# Altium schematic sheet SP100 ATC CCU (SCH).SchDoc
size A2
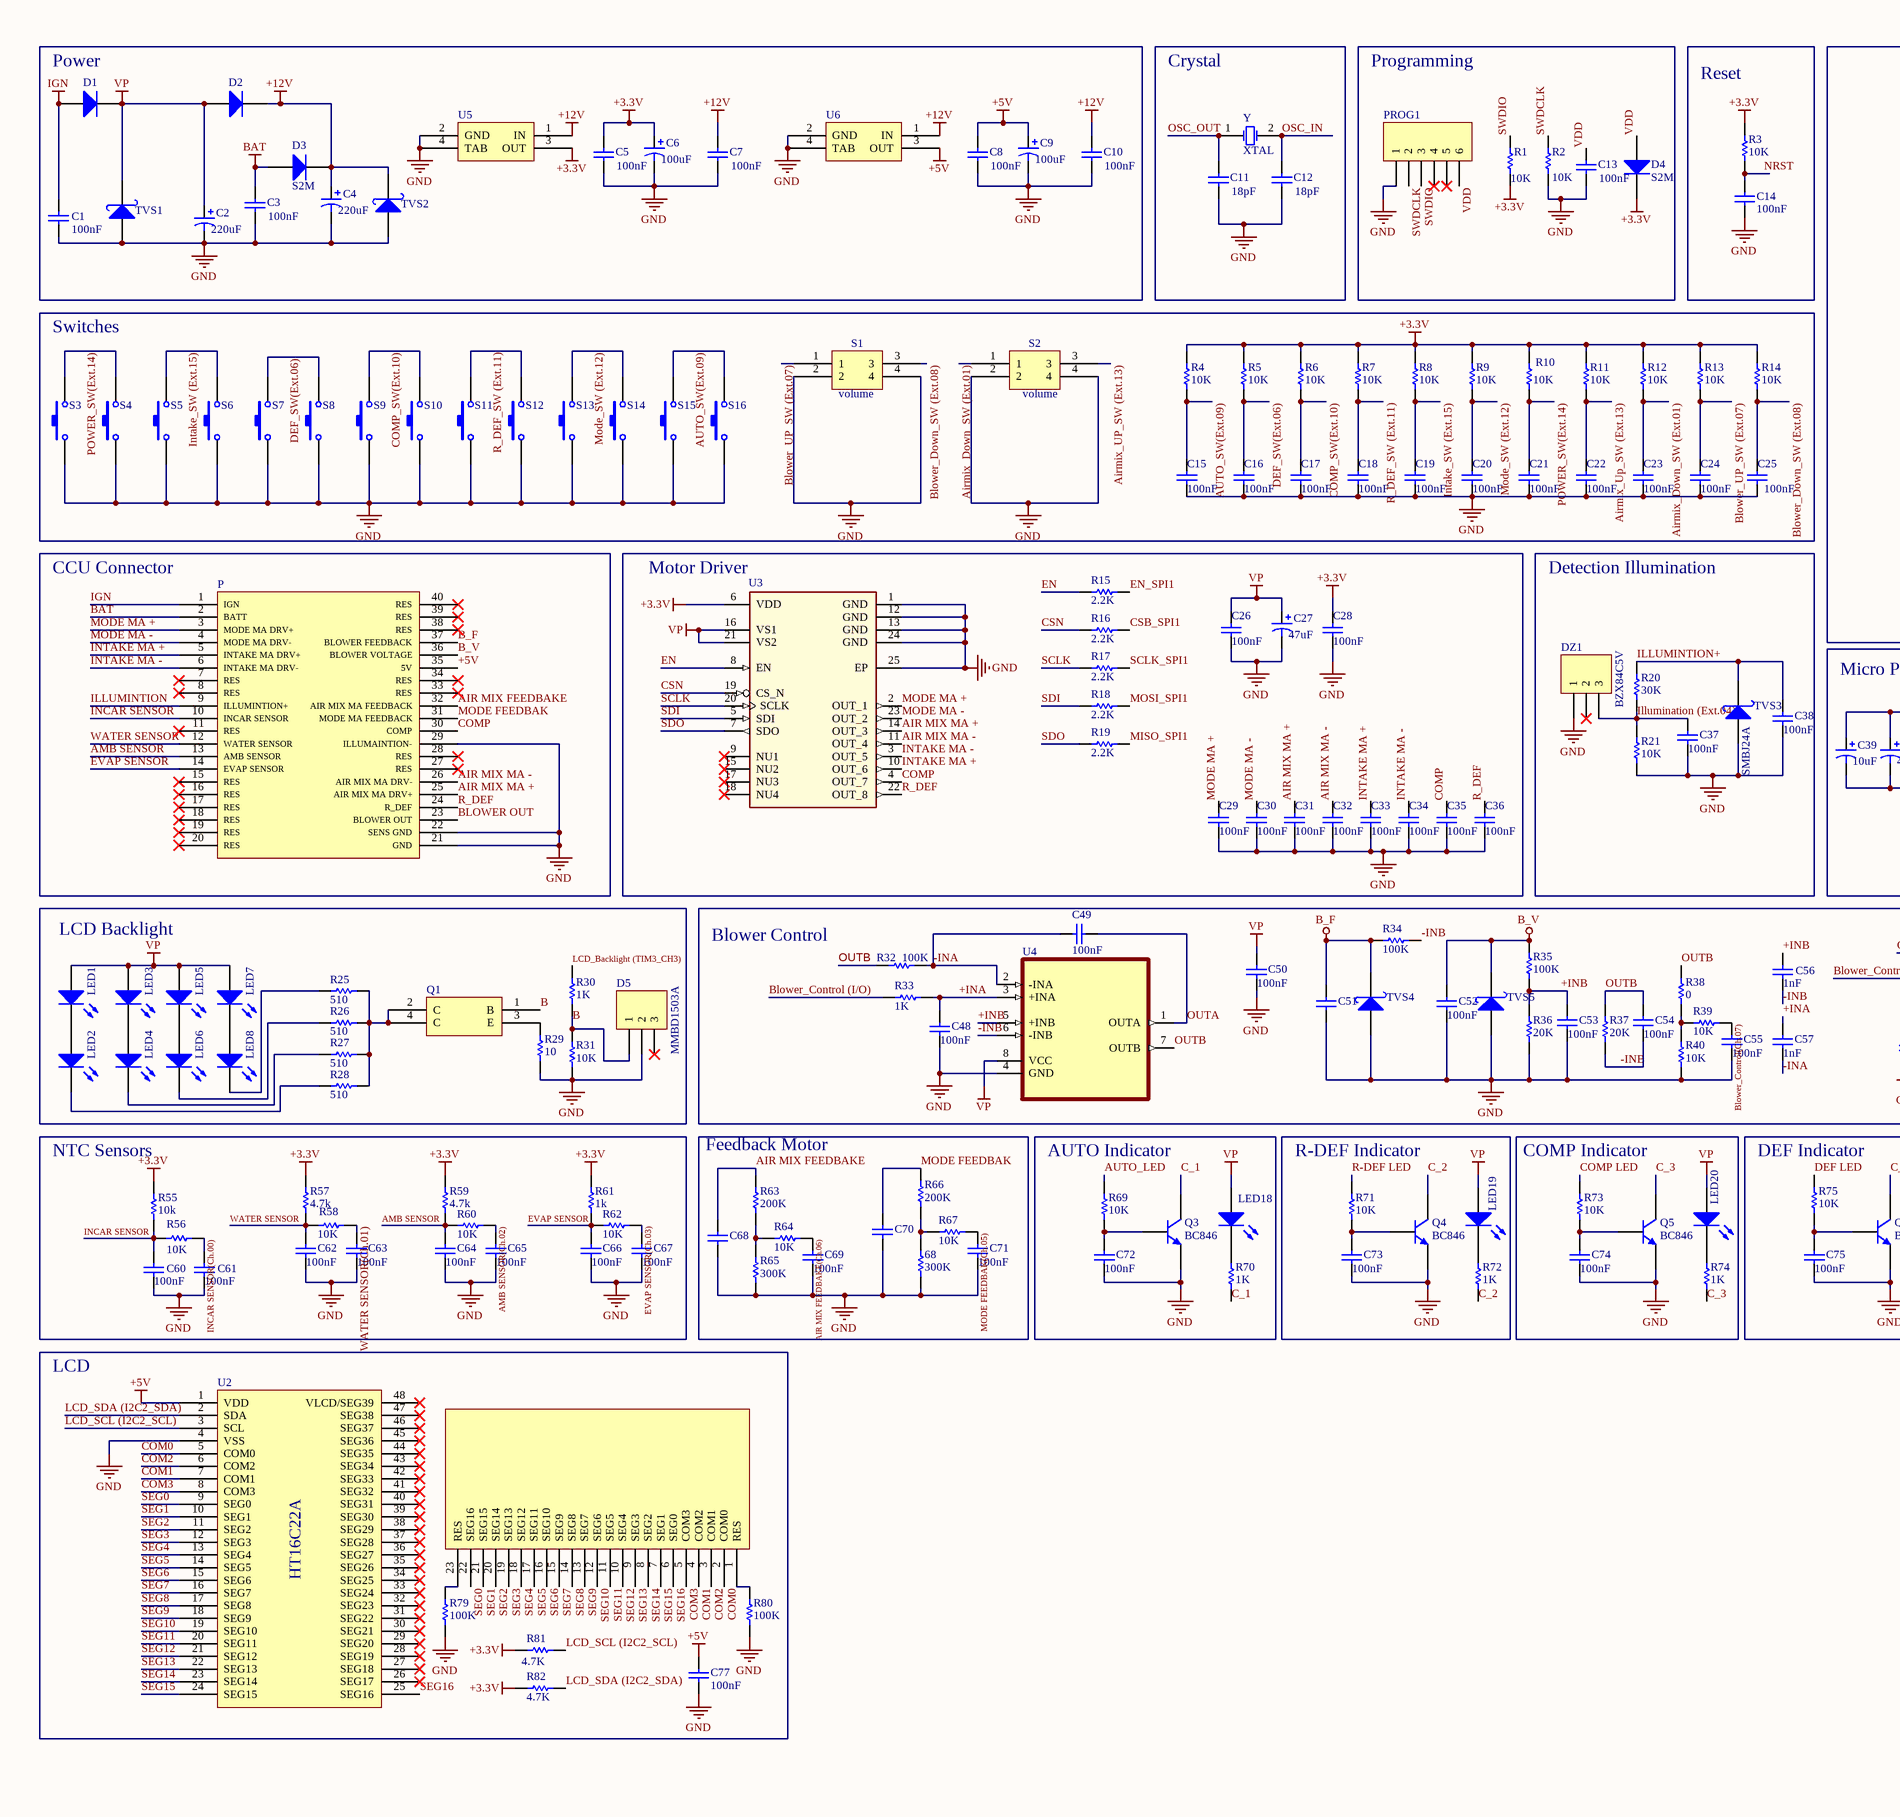
[diagram p0: SP100 ATC CCU (SCH).SchDoc, left]
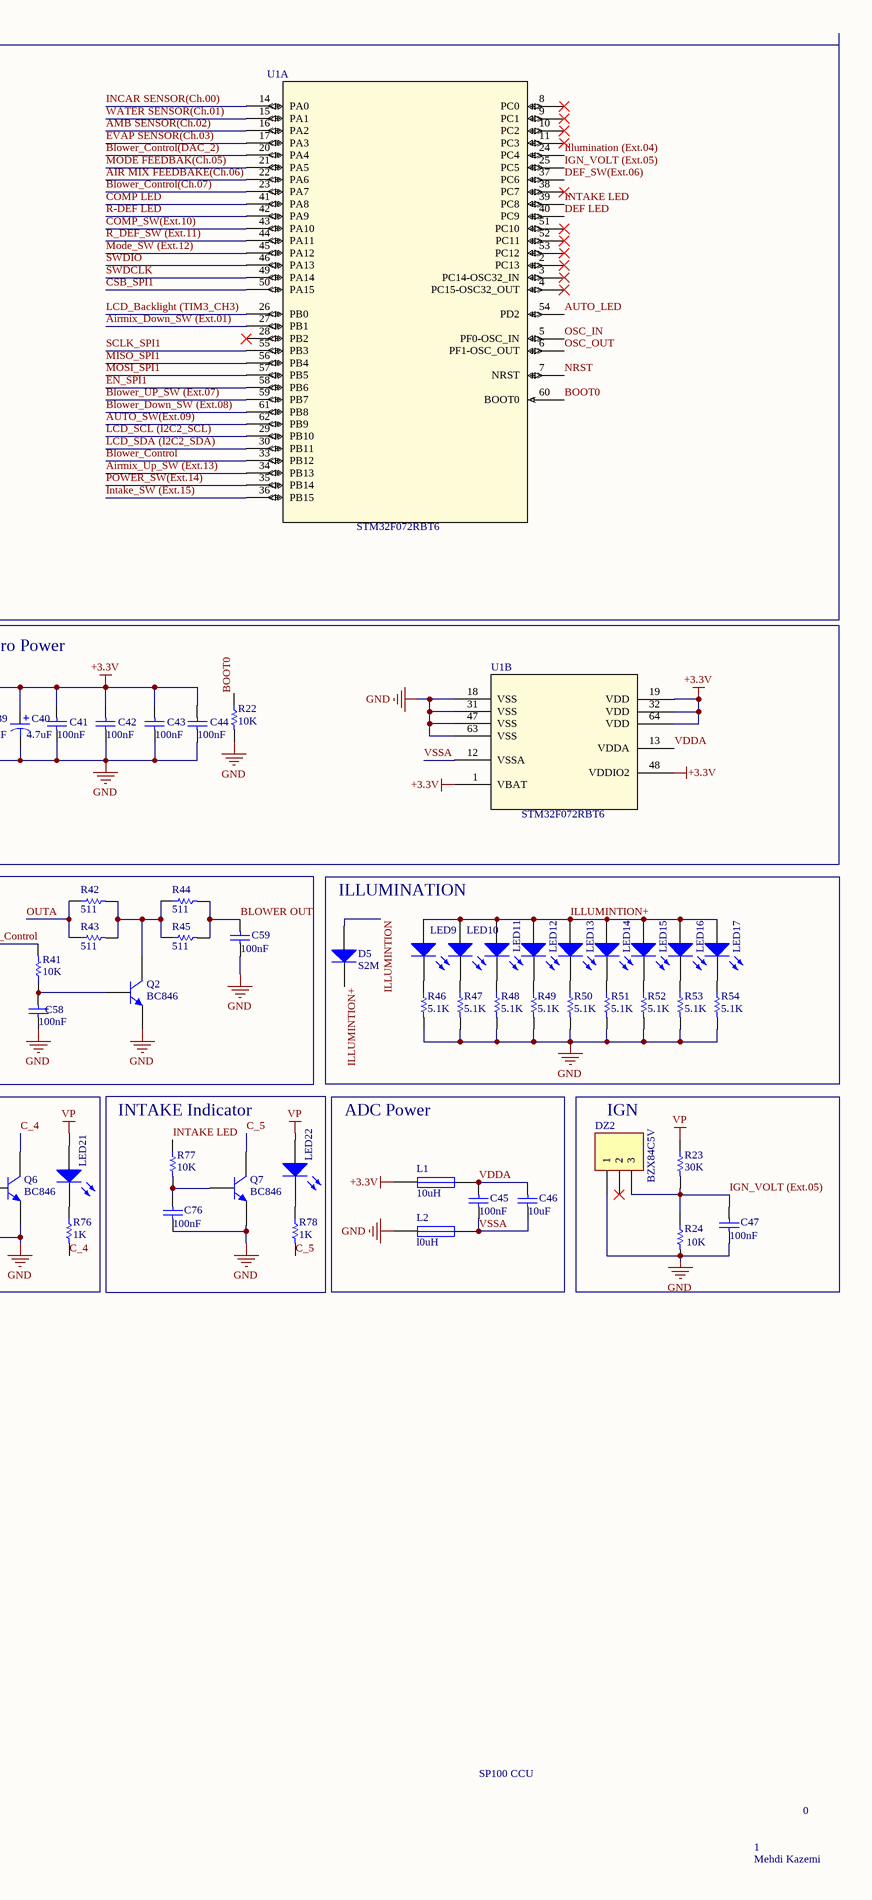
[diagram p1: SP100 ATC CCU (SCH).SchDoc, right]

## Parts
(Parts that share a designator on the sheet are numbered #1, #2 ... from top to bottom, then left to right.)
68  value 300K  [PCBComponent_1]  (hidden comment: Res1)
?  (no value)
C1  value 100nF  [PCBComponent_1]
C2  value 220uF  [PCBComponent_1]
C3  value 100nF  [PCBComponent_1]
C4  value 220uF  [PCBComponent_1]
C5  value 100nF  [PCBComponent_1]
C6  value 100uF  [PCBComponent_1]
C7  value 100nF  [PCBComponent_1]
C8  value 100nF  [PCBComponent_1]
C9  value 100uF  [PCBComponent_1]
C10  value 100nF  [PCBComponent_1]
C11  value 18pF  [PCBComponent_1]
C12  value 18pF  [PCBComponent_1]
C13  value 100nF  [PCBComponent_1]
C14  value 100nF  [PCBComponent_1]  (hidden comment: Cap)
C15  value 100nF  [PCBComponent_1]
C16  value 100nF  [PCBComponent_1]
C17  value 100nF  [PCBComponent_1]
C18  value 100nF  [PCBComponent_1]
C19  value 100nF  [PCBComponent_1]
C20  value 100nF  [PCBComponent_1]
C21  value 100nF  [PCBComponent_1]
C22  value 100nF  [PCBComponent_1]
C23  value 100nF  [PCBComponent_1]
C24  value 100nF  [PCBComponent_1]
C25  value 100nF  [PCBComponent_1]
C26  value 100nF  [PCBComponent_1]
C27  value 47uF  [PCBComponent_1]
C28  value 100nF  [PCBComponent_1]
C29  value 100nF  [PCBComponent_1]
C30  value 100nF  [PCBComponent_1]
C31  value 100nF  [PCBComponent_1]
C32  value 100nF  [PCBComponent_1]
C33  value 100nF  [PCBComponent_1]
C34  value 100nF  [PCBComponent_1]
C35  value 100nF  [PCBComponent_1]
C36  value 100nF  [PCBComponent_1]
C37  value 100nF  [PCBComponent_1]
C38  value 100nF  [PCBComponent_1]
C39  value 10uF  [PCBComponent_1]
C40  value 4.7uF  [PCBComponent_1]
C41  value 100nF  [PCBComponent_1]
C42  value 100nF  [PCBComponent_1]
C43  value 100nF  [PCBComponent_1]
C44  value 100nF  [PCBComponent_1]
C45  value 100nF  [PCBComponent_1]
C46  value 10uF  [PCBComponent_1]
C47  value 100nF  [PCBComponent_1]
C48  value 100nF  [PCBComponent_1]
C49  value 100nF  [PCBComponent_1]
C50  value 100nF  [PCBComponent_1]
C51  (no value)  [PCBComponent_1]
C52  value 100nF  [PCBComponent_1]
C53  value 100nF  [PCBComponent_1]
C54  value 100nF  [PCBComponent_1]
C55  value 100nF  [PCBComponent_1]
C56  value 1nF  [PCBComponent_1]
C57  value 1nF  [PCBComponent_1]
C58  value 100nF  [PCBComponent_1]
C59  value 100nF  [PCBComponent_1]
C60  value 100nF  [PCBComponent_1]
C61  value 100nF  [PCBComponent_1]
C62  value 100nF  [PCBComponent_1]
C63  value 100nF  [PCBComponent_1]
C64  value 100nF  [PCBComponent_1]
C65  value 100nF  [PCBComponent_1]
C66  value 100nF  [PCBComponent_1]
C67  value 100nF  [PCBComponent_1]
C68  (no value)  [PCBComponent_1]
C69  value 100nF  [PCBComponent_1]
C70  (no value)  [PCBComponent_1]
C71  value 100nF  [PCBComponent_1]
C72  value 100nF  [PCBComponent_1]
C73  value 100nF  [PCBComponent_1]
C74  value 100nF  [PCBComponent_1]
C75  value 100nF  [PCBComponent_1]
C76  value 100nF  [PCBComponent_1]
C77  value 100nF  [PCBComponent_1]
D1  (no value)  [PCBComponent_1]
D2  (no value)  [PCBComponent_1]
D3  S2M  [PCBComponent_1]
D4  S2M  [SODFL3517X110N]
D5#1  S2M  [PCBComponent_1]
D5#2  MMBD1503A  [PCBComponent_1]
DZ1  BZX84C5V  [PCBComponent_1]
DZ2  BZX84C5V  [PCBComponent_1]
L1  10uH  [PCBComponent_1]
L2  l0uH  [PCBComponent_1]
LED1  (no value)  [PCBComponent_1]
LED2  (no value)  [PCBComponent_1]
LED3  (no value)  [PCBComponent_1]
LED4  (no value)  [PCBComponent_1]
LED5  (no value)  [PCBComponent_1]
LED6  (no value)  [PCBComponent_1]
LED7  (no value)  [PCBComponent_1]
LED8  (no value)  [PCBComponent_1]
LED9  (no value)  [PCBComponent_1]
LED10  (no value)  [PCBComponent_1]
LED11  (no value)  [PCBComponent_1]
LED12  (no value)  [PCBComponent_1]
LED13  (no value)  [PCBComponent_1]
LED14  (no value)  [PCBComponent_1]
LED15  (no value)  [PCBComponent_1]
LED16  (no value)  [PCBComponent_1]
LED17  (no value)  [PCBComponent_1]
LED18  (no value)  [PCBComponent_1]
LED19  (no value)  [PCBComponent_1]
LED20  (no value)  [PCBComponent_1]
LED21  (no value)  [PCBComponent_1]
LED22  (no value)  [PCBComponent_1]
P  (no value)  [PCBComponent_1]
PROG1  (no value)  [PCBComponent_1]
Q1  (no value)  [*SOT223]
Q2  BC846  [PCBComponent_1]
Q3  BC846  [PCBComponent_1]
Q4  BC846  [PCBComponent_1]
Q5  BC846  [PCBComponent_1]
Q6  BC846  [PCBComponent_1]
Q7  BC846  [PCBComponent_1]
R1  value 10K  [PCBComponent_1]
R2  value 10K  [PCBComponent_1]
R3  value 10K  [PCBComponent_1]  (hidden comment: Res1)
R4  value 10K  [PCBComponent_1]  (hidden comment: Res1)
R5  value 10K  [PCBComponent_1]  (hidden comment: Res1)
R6  value 10K  [PCBComponent_1]  (hidden comment: Res1)
R7  value 10K  [PCBComponent_1]  (hidden comment: Res1)
R8  value 10K  [PCBComponent_1]  (hidden comment: Res1)
R9  value 10K  [PCBComponent_1]  (hidden comment: Res1)
R10  value 10K  [PCBComponent_1]  (hidden comment: Res1)
R11  value 10K  [PCBComponent_1]  (hidden comment: Res1)
R12  value 10K  [PCBComponent_1]  (hidden comment: Res1)
R13  value 10K  [PCBComponent_1]  (hidden comment: Res1)
R14  value 10K  [PCBComponent_1]  (hidden comment: Res1)
R15  value 2.2K  [PCBComponent_1]  (hidden comment: Res1)
R16  value 2.2K  [PCBComponent_1]  (hidden comment: Res1)
R17  value 2.2K  [PCBComponent_1]  (hidden comment: Res1)
R18  value 2.2K  [PCBComponent_1]  (hidden comment: Res1)
R19  value 2.2K  [PCBComponent_1]  (hidden comment: Res1)
R20  value 30K  [PCBComponent_1]  (hidden comment: Res1)
R21  value 10K  [PCBComponent_1]  (hidden comment: Res1)
R22  value 10K  [PCBComponent_1]  (hidden comment: Res1)
R23  value 30K  [PCBComponent_1]  (hidden comment: Res1)
R24  value 10K  [PCBComponent_1]  (hidden comment: Res1)
R25  value 510  [PCBComponent_1]  (hidden comment: Res1)
R26  value 510  [PCBComponent_1]  (hidden comment: Res1)
R27  value 510  [PCBComponent_1]  (hidden comment: Res1)
R28  value 510  [PCBComponent_1]  (hidden comment: Res1)
R29  value 10  [PCBComponent_1]  (hidden comment: Res1)
R30  value 1K  [PCBComponent_1]  (hidden comment: Res1)
R31  value 10K  [PCBComponent_1]  (hidden comment: Res1)
R32  value 100K  [PCBComponent_1]  (hidden comment: Res1)
R33  value 1K  [PCBComponent_1]  (hidden comment: Res1)
R34  value 100K  [PCBComponent_1]  (hidden comment: Res1)
R35  value 100K  [PCBComponent_1]  (hidden comment: Res1)
R36  value 20K  [PCBComponent_1]  (hidden comment: Res1)
R37  value 20K  [PCBComponent_1]  (hidden comment: Res1)
R38  value 0  [PCBComponent_1]  (hidden comment: Res1)
R39  value 10K  [PCBComponent_1]  (hidden comment: Res1)
R40  value 10K  [PCBComponent_1]  (hidden comment: Res1)
R41  value 10K  [PCBComponent_1]  (hidden comment: Res1)
R42  value 511  [PCBComponent_1]  (hidden comment: Res1)
R43  value 511  [PCBComponent_1]  (hidden comment: Res1)
R44  value 511  [PCBComponent_1]  (hidden comment: Res1)
R45  value 511  [PCBComponent_1]  (hidden comment: Res1)
R46  value 5.1K  [PCBComponent_1]  (hidden comment: Res1)
R47  value 5.1K  [PCBComponent_1]  (hidden comment: Res1)
R48  value 5.1K  [PCBComponent_1]  (hidden comment: Res1)
R49  value 5.1K  [PCBComponent_1]  (hidden comment: Res1)
R50  value 5.1K  [PCBComponent_1]  (hidden comment: Res1)
R51  value 5.1K  [PCBComponent_1]  (hidden comment: Res1)
R52  value 5.1K  [PCBComponent_1]  (hidden comment: Res1)
R53  value 5.1K  [PCBComponent_1]  (hidden comment: Res1)
R54  value 5.1K  [PCBComponent_1]  (hidden comment: Res1)
R55  value 10k  [PCBComponent_1]  (hidden comment: Res1)
R56  value 10K  [PCBComponent_1]  (hidden comment: Res1)
R57  value 4.7k  [PCBComponent_1]  (hidden comment: Res1)
R58  value 10K  [PCBComponent_1]  (hidden comment: Res1)
R59  value 4.7k  [PCBComponent_1]  (hidden comment: Res1)
R60  value 10K  [PCBComponent_1]  (hidden comment: Res1)
R61  value 1k  [PCBComponent_1]  (hidden comment: Res1)
R62  value 10K  [PCBComponent_1]  (hidden comment: Res1)
R63  value 200K  [PCBComponent_1]  (hidden comment: Res1)
R64  value 10K  [PCBComponent_1]  (hidden comment: Res1)
R65  value 300K  [PCBComponent_1]  (hidden comment: Res1)
R66  value 200K  [PCBComponent_1]  (hidden comment: Res1)
R67  value 10K  [PCBComponent_1]  (hidden comment: Res1)
R69  value 10K  [PCBComponent_1]  (hidden comment: Res1)
R70  value 1K  [PCBComponent_1]  (hidden comment: Res1)
R71  value 10K  [PCBComponent_1]  (hidden comment: Res1)
R72  value 1K  [PCBComponent_1]  (hidden comment: Res1)
R73  value 10K  [PCBComponent_1]  (hidden comment: Res1)
R74  value 1K  [PCBComponent_1]  (hidden comment: Res1)
R75  value 10K  [PCBComponent_1]  (hidden comment: Res1)
R76  value 1K  [PCBComponent_1]  (hidden comment: Res1)
R77  value 10K  [PCBComponent_1]  (hidden comment: Res1)
R78  value 1K  [PCBComponent_1]  (hidden comment: Res1)
R79  value 100K  [PCBComponent_1]  (hidden comment: Res1)
R80  value 100K  [PCBComponent_1]  (hidden comment: Res1)
R81  value 4.7K  [PCBComponent_1]  (hidden comment: Res1)
R82  value 4.7K  [PCBComponent_1]  (hidden comment: Res1)
S1  volume  [PCBComponent_1]
S2  volume  [PCBComponent_1]
S3  (no value)  [PCBComponent_1]
S4  (no value)  [PCBComponent_1]
S5  (no value)  [PCBComponent_1]
S6  (no value)  [PCBComponent_1]
S7  (no value)  [PCBComponent_1]
S8  (no value)  [PCBComponent_1]
S9  (no value)  [PCBComponent_1]
S10  (no value)  [PCBComponent_1]
S11  (no value)  [PCBComponent_1]
S12  (no value)  [PCBComponent_1]
S13  (no value)  [PCBComponent_1]
S14  (no value)  [PCBComponent_1]
S15  (no value)  [PCBComponent_1]
S16  (no value)  [PCBComponent_1]
TVS1  (no value)  [PCBComponent_1]
TVS2  (no value)  [PCBComponent_1]
TVS3  SMBJ24A  [PCBComponent_1]
TVS4  (no value)  [PCBComponent_1]
TVS5  (no value)  [PCBComponent_1]
U1  STM32F072RBT6  [PCBComponent_1]  (parts A,B of 2)
U2  (no value)  [QFP50P900X900X160-48N]
U3  (no value)  [SOP65P600X115-25N-1]
U4  (no value)  [SOIC127P600X175-8N]
U5  (no value)  [*SOT223]
U6  (no value)  [*SOT223]
Y  XTAL  [PCBComponent_1]

## Nets
+3.3V: C5.2 C6.1 C28.2 C39.1 C40.1 C41.1 C42.1 C43.1 C44.1 D4.2(K) L1.1 R1.1 R3.2 R4.1 R5.1 R6.1 R7.1 R8.1 R9.1 R10.1 R11.1 R12.1 R13.1 R14.1 R55.1 R57.1 R59.1 R61.1 R81.1 R82.1 U1.1(VBAT) U1.19(VDD) U1.32(VDD) U1.48(VDDIO2) U1.64(VDD) U3.6(VDD) U5.3(OUT)
+5V: C8.2 C9.1 C77.2 P.35(5V) U2.1(VDD) U6.3(OUT)
+12V: C4.1 C7.2 C10.2 D2.2(K) D3.2(K) TVS2.2(K) U5.1(IN) U6.1(IN)
B_F: C51.1 P.37(BLOWER_FEEDBACK) R34.1 TVS4.2(K)
B_V: C52.2 P.36(BLOWER_VOLTAGE) R35.1 TVS5.2(K)
BAT: C3.2 D3.1(A) P.2(BATT)
GND: 68.2 C1.1 C2.2 C3.1 C4.2 C5.1 C6.2 C7.1 C8.1 C9.2 C10.1 C11.1 C12.1 C13.1 C14.1 C15.1 C16.1 C17.1 C18.1 C19.1 C20.1 C21.1 C22.1 C23.1 C24.1 C25.1 C26.1 C27.2 C28.1 C29.1 C30.1 C31.1 C32.1 C33.1 C34.1 C35.1 C36.1 C37.1 C38.1 C39.2 C40.2 C41.2 C42.2 C43.2 C44.2 C47.1 C48.1 C50.1 C51.2 C52.1 C53.1 C55.1 C58.1 C59.1 C60.1 C61.1 C62.1 C63.1 C64.1 C65.1 C66.1 C67.1 C68.2 C69.1 C70.2 C71.1 C72.1 C73.1 C74.1 C75.1 C76.1 C77.1 D5#2.2 DZ1.1 DZ2.1 L2.1 P.21(GND) P.22(SENS_GND) P.29(ILLUMAINTION-) PROG1.1 Q2.2(E) Q3.2(E) Q4.2(E) Q5.2(E) Q6.2(E) Q7.2(E) R2.1 R21.2 R22.2 R24.2 R29.2 R31.2 R36.1 R40.2 R46.2 R47.2 R48.2 R49.2 R50.2 R51.2 R52.2 R53.2 R54.2 R65.2 R79.2 R80.2 S1.2 S1.4 S2.2 S2.4 S3.1 S4.1 S5.1 S6.1 S7.1 S8.1 S9.1 S10.1 S11.1 S12.1 S13.1 S14.1 S15.1 S16.1 TVS1.1(A) TVS2.1(A) TVS3.1(A) TVS4.1(A) TVS5.1(A) U1.18(VSS) U1.31(VSS) U1.47(VSS) U1.63(VSS) U2.4(VSS) U3.1(GND) U3.12(GND) U3.13(GND) U3.24(GND) U3.25(EP) U4.4(GND) U5.2(GND) U5.4(TAB) U6.2(GND) U6.4(TAB)
IGN: C1.2 D1.1(A) P.1(IGN)
VP: C2.1 C26.2 C27.1 C50.2 D1.2(K) D2.1(A) LED1.1(A) LED3.1(A) LED5.1(A) LED7.1(A) LED18.1(A) LED19.1(A) LED20.1(A) LED21.1(A) LED22.1(A) R23.1 TVS1.2(K) U3.16(VS1) U3.21(VS2) U4.8(VCC)
+INA: C48.2 C57.2 R33.1 U4.3(+INA)
+INB: C53.2 C56.2 R35.2 R36.2 U4.5(+INB)
-INA: C49.2 C57.1 R32.1 U4.2(-INA)
-INB: C54.1 C56.1 R34.2 R37.2 U4.6(-INB)
AIR MIX FEEDBAKE: C68.1 P.32(AIR_MIX_MA_FEEDBACK) R63.1
AIR MIX FEEDBAKE(Ch.06): C69.2 R64.2 U1.22(PA6)
AIR MIX MA +: C31.2 P.25(AIR_MIX_MA_DRV+) U3.14(OUT_3)
AIR MIX MA -: C32.2 P.26(AIR_MIX_MA_DRV-) U3.11(OUT_4)
Airmix_Down_SW (Ext.01): C23.2 R12.2 S2.1 U1.27(PB1)
Airmix_Up_SW (Ext.13): C22.2 R11.2 S2.3 U1.34(PB13)
AMB SENSOR: C64.2 P.13(AMB_SENSOR) R59.2 R60.2
AMB SENSOR(Ch.02): C65.2 R60.1 U1.16(PA2)
AUTO_LED: R69.1 U1.54(PD2)
AUTO_SW(Ext.09): C15.2 R4.2 S15.2 S16.2 U1.62(PB9)
B: D5#2.1 Q1.1(B) R30.2 R31.1
BLOWER OUT: C59.2 P.23(BLOWER_OUT) R44.2 R45.2
Blower_Control: R41.2 U1.33(PB12)
Blower_Control (I/O): R33.2
Blower_Control(Ch.07): C55.2 R39.2 U1.23(PA7)
Blower_Control(DAC_2): U1.20(PA4)
Blower_Down_SW (Ext.08): C25.2 R14.2 S1.3 U1.61(PB8)
Blower_UP_SW (Ext.07): C24.2 R13.2 S1.1 U1.59(PB7)
BOOT0: R22.1 U1.60(BOOT0)
C_1: Q3.3(C) R70.2
C_2: Q4.3(C) R72.2
C_3: Q5.3(C) R74.2
C_4: Q6.3(C) R76.2
C_5: Q7.3(C) R78.2
COM0: ?.2(COM0) U2.5(COM0)
COM1: ?.4(COM2) U2.7(COM1)
COM2: ?.3(COM1) U2.6(COM2)
COM3: ?.5(COM3) U2.8(COM3)
COMP: C35.2 P.30(COMP) U3.4(OUT_7)
COMP LED: R73.1 U1.41(PA8)
COMP_SW(Ext.10): C17.2 R6.2 S9.2 S10.2 U1.43(PA10)
CSB_SPI1: R16.1 U1.50(PA15)
CSN: R16.2 U3.19(CS_N)
DEF LED: R75.1 U1.40(PC9)
DEF_SW(Ext.06): C16.2 R5.2 S7.2 S8.2 U1.37(PC6)
EN: R15.2 U3.8(EN)
EN_SPI1: R15.1 U1.58(PB6)
EVAP SENSOR: C66.2 P.14(EVAP_SENSOR) R61.2 R62.2
EVAP SENSOR(Ch.03): C67.2 R62.1 U1.17(PA3)
IGN_VOLT (Ext.05): C47.2 DZ2.3 R23.2 R24.1 U1.25(PC5)
Illumination (Ext.04): C37.2 DZ1.3 R20.2 R21.1 U1.24(PC4)
ILLUMINTION: D5#1.1(A) P.9(ILLUMINTION+)
ILLUMINTION+: C38.2 D5#1.2(K) LED9.1(A) LED10.1(A) LED11.1(A) LED12.1(A) LED13.1(A) LED14.1(A) LED15.1(A) LED16.1(A) LED17.1(A) R20.1 TVS3.2(K)
INCAR SENSOR: C60.2 P.10(INCAR_SENSOR) R55.2 R56.2
INCAR SENSOR(Ch.00): C61.2 R56.1 U1.14(PA0)
INTAKE LED: R77.1 U1.39(PC8)
INTAKE MA +: C33.2 P.5(INTAKE_MA_DRV+) U3.10(OUT_6)
INTAKE MA -: C34.2 P.6(INTAKE_MA_DRV-) U3.3(OUT_5)
Intake_SW (Ext.15): C19.2 R8.2 S5.2 S6.2 U1.36(PB15)
LCD_Backlight (TIM3_CH3): R30.1 U1.26(PB0)
LCD_SCL (I2C2_SCL): R81.2 U1.29(PB10) U2.3(SCL)
LCD_SDA (I2C2_SDA): R82.2 U1.30(PB11) U2.2(SDA)
MISO_SPI1: R19.1 U1.56(PB4)
MODE FEEDBAK: C70.1 P.31(MODE_MA_FEEDBACK) R66.1
MODE FEEDBAK(Ch.05): C71.2 R67.2 U1.21(PA5)
MODE MA +: C29.2 P.3(MODE_MA_DRV+) U3.2(OUT_1)
MODE MA -: C30.2 P.4(MODE_MA_DRV-) U3.23(OUT_2)
Mode_SW (Ext.12): C20.2 R9.2 S13.2 S14.2 U1.45(PA12)
MOSI_SPI1: R18.1 U1.57(PB5)
NRST: C14.2 R3.1 U1.7(NRST)
OSC_IN: C12.2 U1.5(PF0-OSC_IN) Y.2(OSC2)
OSC_OUT: C11.2 U1.6(PF1-OSC_OUT) Y.1(OSC1)
OUTA: C49.1 R42.1 R43.1 U4.1(OUTA)
OUTB: C54.2 R32.2 R37.1 R38.1 U4.7(OUTB)
POWER_SW(Ext.14): C21.2 R10.2 S3.2 S4.2 U1.35(PB14)
R-DEF LED: R71.1 U1.42(PA9)
R_DEF: C36.2 P.24(R_DEF) U3.22(OUT_8)
R_DEF_SW (Ext.11): C18.2 R7.2 S11.2 S12.2 U1.44(PA11)
SCLK: R17.2 U3.20(SCLK)
SCLK_SPI1: R17.1 U1.55(PB3)
SDI: R18.2 U3.5(SDI)
SDO: R19.2 U3.7(SDO)
SEG0: ?.22(SEG16) U2.9(SEG0)
SEG1: ?.21(SEG15) U2.10(SEG1)
SEG2: ?.20(SEG14) U2.11(SEG2)
SEG3: ?.19(SEG13) U2.12(SEG3)
SEG4: ?.18(SEG12) U2.13(SEG4)
SEG5: ?.17(SEG11) U2.14(SEG5)
SEG6: ?.16(SEG10) U2.15(SEG6)
SEG7: ?.15(SEG9) U2.16(SEG7)
SEG8: ?.14(SEG8) U2.17(SEG8)
SEG9: ?.13(SEG7) U2.18(SEG9)
SEG10: ?.12(SEG6) U2.19(SEG10)
SEG11: ?.11(SEG5) U2.20(SEG11)
SEG12: ?.10(SEG4) U2.21(SEG12)
SEG13: ?.9(SEG3) U2.22(SEG13)
SEG14: ?.8(SEG2) U2.23(SEG14)
SEG15: ?.7(SEG1) U2.24(SEG15)
SEG16: ?.6(SEG0) U2.25(SEG16)
SWDCLK: PROG1.2 R2.2 U1.49(PA14)
SWDIO: PROG1.3 R1.2 U1.46(PA13)
VDD: C13.2 D4.1(A) PROG1.6
VDDA: C45.2 C46.1 L1.2 U1.13(VDDA)
VSSA: C45.1 C46.2 L2.2 U1.12(VSSA)
WATER SENSOR: C62.2 P.12(WATER_SENSOR) R57.2 R58.2
WATER SENSOR(Ch.01): C63.2 R58.1 U1.15(PA1)
Net68_1: 68.1 R66.2 R67.1
Net?_1: ?.1(RES) R80.1
Net?_23: ?.23(RES) R79.1
NetC58_2: C58.2 Q2.1(B) R41.1
NetC72_2: C72.2 Q3.1(B) R69.2
NetC73_2: C73.2 Q4.1(B) R71.2
NetC74_2: C74.2 Q5.1(B) R73.2
NetC75_2: C75.2 Q6.1(B) R75.2
NetC76_2: C76.2 Q7.1(B) R77.2
NetLED1_2: LED1.2(K) LED2.1(A)
NetLED2_2: LED2.2(K) R28.1
NetLED3_2: LED3.2(K) LED4.1(A)
NetLED4_2: LED4.2(K) R27.1
NetLED5_2: LED5.2(K) LED6.1(A)
NetLED6_2: LED6.2(K) R26.1
NetLED7_2: LED7.2(K) LED8.1(A)
NetLED8_2: LED8.2(K) R25.1
NetLED9_2: LED9.2(K) R46.1
NetLED10_2: LED10.2(K) R47.1
NetLED11_2: LED11.2(K) R48.1
NetLED12_2: LED12.2(K) R49.1
NetLED13_2: LED13.2(K) R50.1
NetLED14_2: LED14.2(K) R51.1
NetLED15_2: LED15.2(K) R52.1
NetLED16_2: LED16.2(K) R53.1
NetLED17_2: LED17.2(K) R54.1
NetLED18_2: LED18.2(K) R70.1
NetLED19_2: LED19.2(K) R72.1
NetLED20_2: LED20.2(K) R74.1
NetLED21_2: LED21.2(K) R76.1
NetLED22_2: LED22.2(K) R78.1
NetQ1_2: Q1.2(C) Q1.4(C) R25.2 R26.2 R27.2 R28.2
NetQ1_3: Q1.3(E) R29.1
NetQ2_3: Q2.3(C) R42.2 R43.2 R44.1 R45.1
NetR38_2: R38.2 R39.1 R40.1
NetR63_2: R63.2 R64.1 R65.1

Not connected (* = marked no-connect by the designer): D5#2 3*; DZ1 2*; DZ2 2*; P 7(RES)* 8(RES)* 11(RES)* 15(RES)* 16(RES)* 17(RES)* 18(RES)* 19(RES)* 20(RES)* 27(RES)* 28(RES)* 33(RES)* 34(RES)* 38(RES)* 39(RES)* 40(RES)*; PROG1 4* 5*; U1 2(PC13)* 3(PC14-OSC32_IN)* 4(PC15-OSC32_OUT)* 8(PC0)* 9(PC1)* 10(PC2)* 11(PC3)* 28(PB2)* 38(PC7)* 51(PC10)* 52(PC11)* 53(PC12)*; U2 26(SEG17)* 27(SEG18)* 28(SEG19)* 29(SEG20)* 30(SEG21)* 31(SEG22)* 32(SEG23)* 33(SEG24)* 34(SEG25)* 35(SEG26)* 36(SEG27)* 37(SEG28)* 38(SEG29)* 39(SEG30)* 40(SEG31)* 41(SEG32)* 42(SEG33)* 43(SEG34)* 44(SEG35)* 45(SEG36)* 46(SEG37)* 47(SEG38)* 48(VLCD/SEG39)*; U3 9(NU1)* 15(NU2)* 17(NU3)* 18(NU4)*

## Notes on the sheet
- (near D1) Power
- Crystal
- Programming
- Reset
- Switches
- CCU Connector
- (near U3) Motor Driver
- Detection Illumination
- Micro Power
- LCD Backlight
- Blower Control
- ILLUMINATION
- (near R55) NTC Sensors
- (near R63) Feedback Motor
- (near R69) AUTO Indicator
- (near R71) R-DEF Indicator
- (near R73) COMP Indicator
- (near R75) DEF Indicator
- (near R77) INTAKE Indicator
- ADC Power
- IGN
- LCD
- SP100 CCU
- Mehdi Kazemi
- 1
- 0
- (in symbol Component_1) HT16C22A

## Library data of the parts
68 R1-R67 R69-R82 = Res1: Resistor; Published: 8-Jun-2000; LatestRevisionDate: 17-Jul-2002; LatestRevisionNote: Re-released for DXP Platform.; PackageReference: AXIAL-0.3; Publisher: Altium Limited
  R1 R2: PackageDescription: Axial Device, Thru-Hole; 2 Leads; 0.3 in Pin Spacing
? P Q1 U2 U5 U6 = Component_1
C1 C3 C5 C7 C8 C10-C26 C28-C38 C41-C77 = Cap: Capacitor; Published: 8-Jun-2000; LatestRevisionDate: 17-Jul-2002; LatestRevisionNote: Re-released for DXP Platform.; PackageReference: RAD-0.3; Publisher: Altium Limited
  C1 C3 C5 C7 C8 C10-C13 C15-C26 C28-C38 C41-C77: PackageDescription: Radial Cap, Thru-Hole; 2 Leads; 0.3 in Pin Spacing
C2 C4 C6 C9 C27 C39 C40 = Cap Pol1: Polarized Capacitor (Radial); Published: 8-Jun-2000; LatestRevisionDate: 17-Jul-2002; LatestRevisionNote: Re-released for DXP Platform.; PackageReference: RB7.6-15; Publisher: Altium Limited; PackageDescription: Polarized Capacitor (Radial); 2 Leads
D1-D4 D5#1 = Diode: Default Diode; Published: 8-Jun-2000; LatestRevisionDate: 17-Jul-2002; LatestRevisionNote: Re-released for DXP Platform.; PackageVersion: Sep-1996; PackageReference: SMC; Publisher: Altium Limited; PackageDescription: DO-214-AB/SMC; 2 C-Bend Leads; Body 7.9 x 5.9 mm, inc. leads (LxW); Code_JEDEC: DO-214-AB
D5#2 DZ1 DZ2 = Header 3: Header, 3-Pin; LatestRevisionDate: 17-Jul-2002; LatestRevisionNote: Re-released for DXP Platform.; Publisher: Altium Limited
L1 L2 = Fuse 1: Fuse; Published: 8-Jun-2000; LatestRevisionDate: 17-Jul-2002; LatestRevisionNote: Re-released for DXP Platform.; PackageReference: PIN-W2/E2.8; Publisher: Altium Limited; PackageDescription: Thru-Hole; 2 Leads
LED1-LED8 LED11-LED17 = LED0: Typical INFRARED GaAs LED; Published: 8-Jun-2000; LatestRevisionDate: 08-Jul-2005; LatestRevisionNote: Mech Layer 1 removed.; PackageReference: LED-0; Publisher: Altium Limited; PackageDescription: LED; 2 Leads
LED9 LED10 LED18-LED22 = LED1: Typical RED GaAs LED; Published: 8-Jun-2000; LatestRevisionDate: 08-Jul-2005; LatestRevisionNote: Mech Layer 1 removed.; PackageReference: LED-1; Publisher: Altium Limited; PackageDescription: LED; 2 Leads
PROG1 = Header 6: Header, 6-Pin; LatestRevisionDate: 17-Jul-2002; LatestRevisionNote: Re-released for DXP Platform.; Publisher: Altium Limited
Q2-Q7 = BC337: 45 V, 500 mA NPN transistors; Published: 2017-2-8; LatestRevisionDate: 2017; LatestRevisionNote: IPC-7351 Footprint Added.; DatasheetVersion: 2017; PackageVersion: 2017-2-8; PackageReference: SOT23; Publisher: Abbas Basereh; PackageDescription: 3-Pin SOT-23 Package 0.95 mm Pitch, 2.3 mm Lead Span; ComponentLink1Description: Manufacturer Link; ComponentLink1URL: http://www.nxp.com/; ComponentLink2Description: Datasheet; ComponentLink2URL: http://www.nxp.com/
S1 S2 = Component_2
S3-S16 = Switch PB: Push Button Switch
TVS1-TVS5 = 1n5822 SMD: SMDJ28A
U1 = STM32F072RBT6: No Description Available; Mfr_Name: STMicroelectronics; Copyright: Copyright (C) 2021 Ultra Librarian. All rights reserved.; Manufacturer_Part_Number: STM32F072RBT6; RefDes: RefDes; Type: DEV
U3 = TLE94108ES: Protected Eight-Fold Half-Bridge Driver; Manufacturer: Infineon Technologies; Manufacturer Order Number: TLE94108ES; PackageReference: PG-SSOP-24
U4 = LM2904M: General Purpose Amplifier 2 Circuit 8-SOIC; MF: Texas Instruments; Availability: Unavailable; Package: SO-8 Texas Instruments; SnapEDA_Link: https://www.snapeda.com/parts/LM2904M/Texas%20Instruments/view-part/343732/?ref=snap; Price: None; MP: LM2904M; Value: *
Y = XTAL: Crystal Oscillator; Published: 8-Jun-2000; LatestRevisionDate: 17-Jul-2002; LatestRevisionNote: Re-released for DXP Platform.; PackageReference: R38; Publisher: Altium Limited; PackageDescription: Crystal, Thru-Hole; 2 Leads; Body 3.1 x 8.2 mm (Dia.xH)